# Altium schematic sheet Underwater_ROV_Sensors.SchDoc
size A
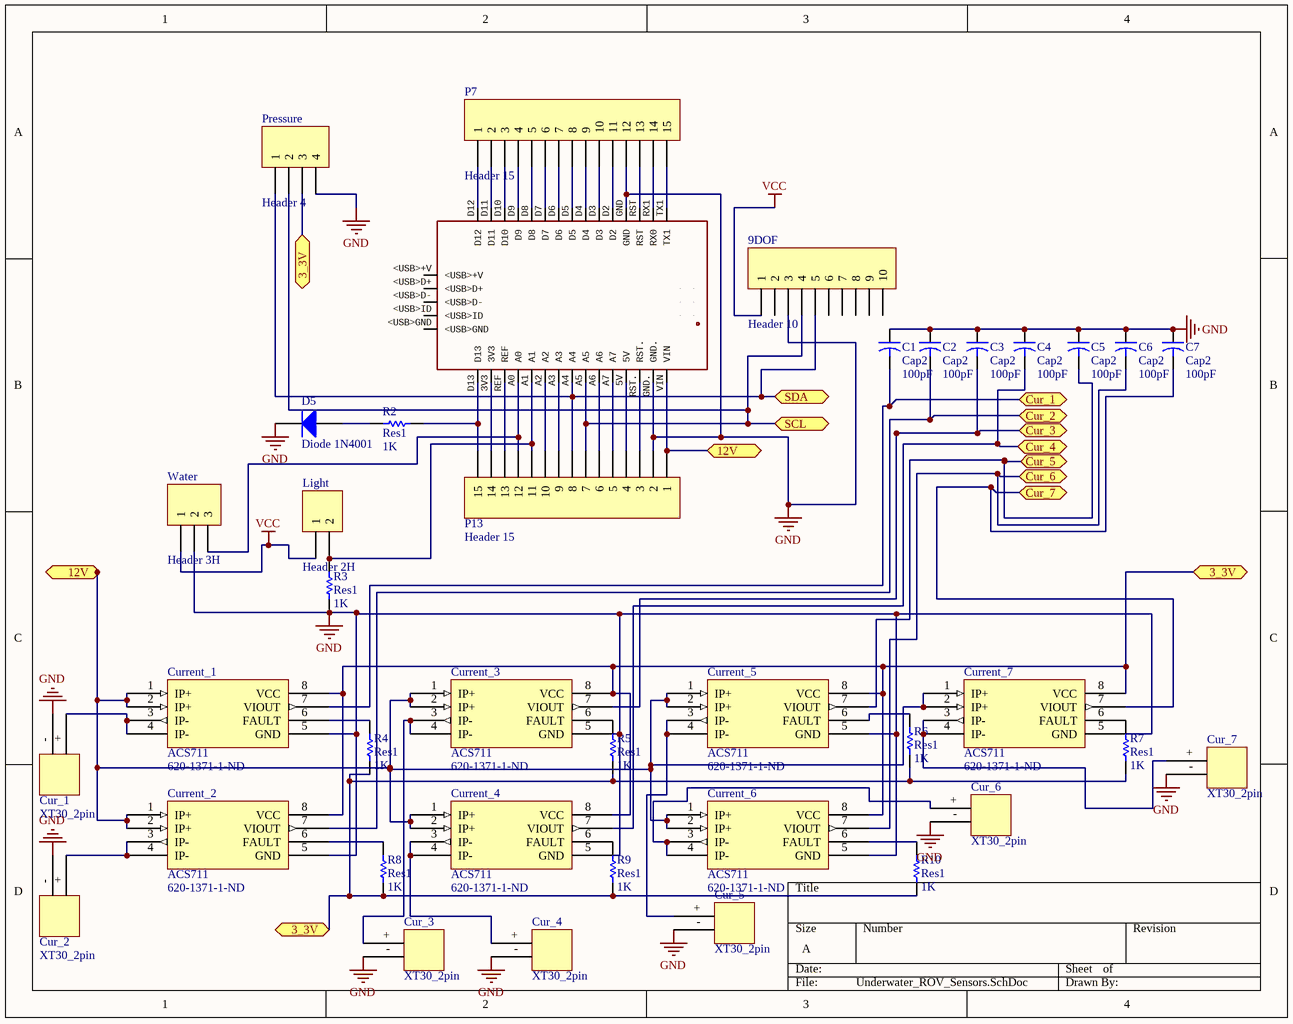
[diagram p0: Underwater_ROV_Sensors.SchDoc]

## Parts
9DOF  Header 10  [HDR1X10]
C1  Cap2  value 100pF  [CAPR5-4X5]
C2  Cap2  value 100pF  [CAPR5-4X5]
C3  Cap2  value 100pF  [CAPR5-4X5]
C4  Cap2  value 100pF  [CAPR5-4X5]
C5  Cap2  value 100pF  [CAPR5-4X5]
C6  Cap2  value 100pF  [CAPR5-4X5]
C7  Cap2  value 100pF  [CAPR5-4X5]
Cur_1  XT30_2pin  [XT30_2pin]
Cur_2  XT30_2pin  [XT30_2pin]
Cur_3  XT30_2pin  [XT30_2pin]
Cur_4  XT30_2pin  [XT30_2pin]
Cur_5  XT30_2pin  [XT30_2pin]
Cur_6  XT30_2pin  [XT30_2pin]
Cur_7  XT30_2pin  [XT30_2pin]
Current_1  ACS711  Supplier Part Number 1: 620-1371-1-ND  [SOIC127P600X175-8N]
Current_2  ACS711  Supplier Part Number 1: 620-1371-1-ND  [SOIC127P600X175-8N]
Current_3  ACS711  Supplier Part Number 1: 620-1371-1-ND  [SOIC127P600X175-8N]
Current_4  ACS711  Supplier Part Number 1: 620-1371-1-ND  [SOIC127P600X175-8N]
Current_5  ACS711  Supplier Part Number 1: 620-1371-1-ND  [SOIC127P600X175-8N]
Current_6  ACS711  Supplier Part Number 1: 620-1371-1-ND  [SOIC127P600X175-8N]
Current_7  ACS711  Supplier Part Number 1: 620-1371-1-ND  [SOIC127P600X175-8N]
D5  Diode 1N4001  [DO-41]
Light  Header 2H  [HDR1X2H]
Nano_sens  Device for representing an Arduino Nano board with a footprint in an EAGLE design. Created by Dave Young for Element14. More EAGLE documentation at: http://www.element14.com/community/community/knode/cadsoft_eagle  [ARDUINO_NANO]  (value not drawn)
P7  Header 15  [HDR1X15]
P13  Header 15  [HDR1X15]
Pressure  Header 4  [HDR1X4]
R2  Res1  value 1K  [AXIAL-0.3]
R3  Res1  value 1K  [AXIAL-0.3]
R4  Res1  value 1K  [AXIAL-0.3]
R5  Res1  value 1K  [AXIAL-0.3]
R6  Res1  value 1K  [AXIAL-0.3]
R7  Res1  value 1K  [AXIAL-0.3]
R8  Res1  value 1K  [AXIAL-0.3]
R9  Res1  value 1K  [AXIAL-0.3]
R10  Res1  value 1K  [AXIAL-0.3]
Water  Header 3H  [HDR1X3H]

## Ports
3_3V (bidir), 12V (bidir), Cur_1 (bidir), Cur_2, Cur_3, Cur_4 (bidir), Cur_5, Cur_6, Cur_7, SCL (bidir), SDA (bidir)

## Nets
GND: 9DOF.3 C1.1 C2.1 C3.1 C4.1 C5.1 C6.1 C7.1 Cur_1.- Cur_2.- Cur_3.- Cur_4.- Cur_5.- Cur_6.- Cur_7.- Current_1.5(GND) Current_2.5(GND) Current_3.5(GND) Current_4.5(GND) Current_5.5(GND) Current_6.5(GND) Current_7.5(GND) D5.2(K) Nano_sens.GND Nano_sens.GND. P7.12 P13.2 Pressure.4 R3.1 Water.2
VCC: 9DOF.1 Light.1 Water.1
3_3V: Current_1.8(VCC) Current_2.8(VCC) Current_3.8(VCC) Current_4.8(VCC) Current_5.8(VCC) Current_6.8(VCC) Current_7.8(VCC) Pressure.3 R4.1 R5.1 R6.1 R7.1 R8.1 R9.1 R10.1 ; port 3_3V
12V: Current_1.1(IP+) Current_1.2(IP+) Current_2.1(IP+) Current_2.2(IP+) Current_3.1(IP+) Current_3.2(IP+) Current_4.1(IP+) Current_4.2(IP+) Current_5.1(IP+) Current_5.2(IP+) Current_6.1(IP+) Current_6.2(IP+) Current_7.1(IP+) Current_7.2(IP+) Nano_sens.VIN P13.1 ; port 12V
Cur_1: C1.2 Current_1.7(VIOUT) ; port Cur_1
Cur_2: C2.2 Current_2.7(VIOUT) ; port Cur_2
Cur_3: C3.2 Current_3.7(VIOUT) ; port Cur_3
Cur_4: C4.2 Current_4.7(VIOUT) ; port Cur_4
Cur_5: C5.2 Current_5.7(VIOUT) ; port Cur_5
Cur_6: C6.2 Current_6.7(VIOUT) ; port Cur_6
Cur_7: C7.2 Current_7.7(VIOUT) ; port Cur_7
SCL: 9DOF.4 Nano_sens.A5 P13.7 Pressure.2 ; port SCL
SDA: 9DOF.5 Nano_sens.A4 P13.8 Pressure.1 ; port SDA
NetCur_1_+: Cur_1.+ Current_1.3(IP-) Current_1.4(IP-)
NetCur_2_+: Cur_2.+ Current_2.3(IP-) Current_2.4(IP-)
NetCur_3_+: Cur_3.+ Current_3.3(IP-) Current_3.4(IP-)
NetCur_4_+: Cur_4.+ Current_4.3(IP-) Current_4.4(IP-)
NetCur_5_+: Cur_5.+ Current_5.3(IP-) Current_5.4(IP-)
NetCur_6_+: Cur_6.+ Current_6.3(IP-) Current_6.4(IP-)
NetCur_7_+: Cur_7.+ Current_7.3(IP-) Current_7.4(IP-)
NetCurrent_1_6: Current_1.6(FAULT) R4.2
NetCurrent_2_6: Current_2.6(FAULT) R8.2
NetCurrent_3_6: Current_3.6(FAULT) R5.2
NetCurrent_4_6: Current_4.6(FAULT) R9.2
NetCurrent_5_6: Current_5.6(FAULT) R6.2
NetCurrent_6_6: Current_6.6(FAULT) R10.2
NetCurrent_7_6: Current_7.6(FAULT) R7.2
NetD5_1: D5.1(A) R2.1
NetLight_2: Light.2 Nano_sens.A1 P13.11 R3.2
NetNano_sens_3V3: Nano_sens.3V3 P13.14
NetNano_sens_5V: Nano_sens.5V P13.4
NetNano_sens_A0: Nano_sens.A0 P13.12 Water.3
NetNano_sens_A2: Nano_sens.A2 P13.10
NetNano_sens_A3: Nano_sens.A3 P13.9
NetNano_sens_A6: Nano_sens.A6 P13.6
NetNano_sens_A7: Nano_sens.A7 P13.5
NetNano_sens_D2: Nano_sens.D2 P7.11
NetNano_sens_D3: Nano_sens.D3 P7.10
NetNano_sens_D4: Nano_sens.D4 P7.9
NetNano_sens_D5: Nano_sens.D5 P7.8
NetNano_sens_D6: Nano_sens.D6 P7.7
NetNano_sens_D7: Nano_sens.D7 P7.6
NetNano_sens_D8: Nano_sens.D8 P7.5
NetNano_sens_D9: Nano_sens.D9 P7.4
NetNano_sens_D10: Nano_sens.D10 P7.3
NetNano_sens_D11: Nano_sens.D11 P7.2
NetNano_sens_D12: Nano_sens.D12 P7.1
NetNano_sens_D13: Nano_sens.D13 P13.15 R2.2
NetNano_sens_REF: Nano_sens.REF P13.13
NetNano_sens_RST: Nano_sens.RST P7.13
NetNano_sens_RST.: Nano_sens.RST. P13.3
NetNano_sens_RX1: Nano_sens.RX1(RX0) P7.14
NetNano_sens_TX1: Nano_sens.TX1 P7.15

Not connected (* = marked no-connect by the designer): 9DOF 2 6 7 8 9 10; Nano_sens 5V. <USB>+V <USB>D+ <USB>D- <USB>GND <USB>ID GND_ MISO MOSI RESET.. SCK

## Library data of the parts
9DOF = Header 10: Header, 10-Pin; LatestRevisionDate: 17-Jul-2002; LatestRevisionNote: Re-released for DXP Platform.; Publisher: Altium Limited
C1-C7 = Cap2: Capacitor; Published: 23-Sep-2002; PackageReference: CAPR5-4X5; Publisher: Altium Limited; PackageDescription: Capacitor; 2 Leads
Current_1-Current_7 = ACS711: Manufacturer: Allegro MicroSystems, LLC; Manufacturer Part Number: ACS711ELCTR-25AB-T; For Measuring: AC/DC; Sensor Type: Hall Effect, Open Loop; Current - Sensing: 25A; Output: Ratiometric, Voltage; Sensitivity: 55mV/A; Frequency: DC ~ 100kHz; Linearity: ±1%; Accuracy: ±4%; Voltage - Supply: 3 V ~ 5.5 V; Response Time: 4.6µs; Current - Supply (Max): 5.5mA; Polarization: Bidirectional; Supplier 1: Digi-Key; RoHS: RoHS Compliant; Category: Sensors, Transducers; Stock 1: 19632; Pricing 1: 1=3.36, 5=3.116, 10=2.588, 25=2.1568, 50=1.9174, 100=1.8214, 500=1.53384, 1000=1.43798 (USD); Packaging: Cut Tape (CT); Part Status: Active; Operating Temperature: -40°C ~ 85°C; Mounting Type: Surface Mount; Package / Case: 8-SOIC (0.154", 3.90mm Width); ComponentLink1URL: http://www.allegromicro.com/~/media/Files/Datasheets/ACS711-Datasheet.ashx; ComponentLink1Description: http://www.allegromicro.com/~/media/Files/Datasheets/ACS711-Datasheet.ashx
D5 = Diode 1N4001: 1 Amp General Purpose Rectifier; Published: 8-Jun-2000; LatestRevisionDate: 17-Jul-2002; LatestRevisionNote: Re-released for DXP Platform.; DatasheetVersion: 1998; PackageVersion: Aug-1999; PackageReference: DO-41; Publisher: Altium Limited; PackageDescription: Diode, Axial; Body 5.2 x 2.7 mm (LxDia. max), Lead Dia. 0.86 mm (max); Code_JEDEC: DO-204-AL; ComponentLink1Description: Manufacturer Link; ComponentLink1URL: http://www.fairchildsemi.com/; ComponentLink2Description: Datasheet; ComponentLink2URL: http://www.fairchildsemi.com/ds/1N%2F1N4001.pdf
Light = Header 2H: Header, 2-Pin, Right Angle; LatestRevisionDate: 17-Jul-2002; LatestRevisionNote: Re-released for DXP Platform.; Publisher: Altium Limited
Nano_sens = ARDUINO_NANO
P7 P13 = Header 15: Header, 15-Pin; LatestRevisionDate: 17-Jul-2002; LatestRevisionNote: Re-released for DXP Platform.; Publisher: Altium Limited
Pressure = Header 4: Header, 4-Pin; LatestRevisionDate: 17-Jul-2002; LatestRevisionNote: Re-released for DXP Platform.; Publisher: Altium Limited
R2-R10 = Res1: Resistor; Published: 8-Jun-2000; LatestRevisionDate: 17-Jul-2002; LatestRevisionNote: Re-released for DXP Platform.; PackageReference: AXIAL-0.3; Publisher: Altium Limited; PackageDescription: Axial Device, Thru-Hole; 2 Leads; 0.3 in Pin Spacing
Water = Header 3H: Header, 3-Pin, Right Angle; LatestRevisionDate: 17-Jul-2002; LatestRevisionNote: Re-released for DXP Platform.; Publisher: Altium Limited